# Altium schematic sheet BSPD_002.SchDoc: =DocumentName
size A3; Organization: Queen's Formula SAE; Address1: 130 Stuart St, Kingston; Address2: Ontario; Address3: Canada; Address4: K7L 2V9; DocumentNumber: 1; Revision: 0; SheetNumber: 1; SheetTotal: 1
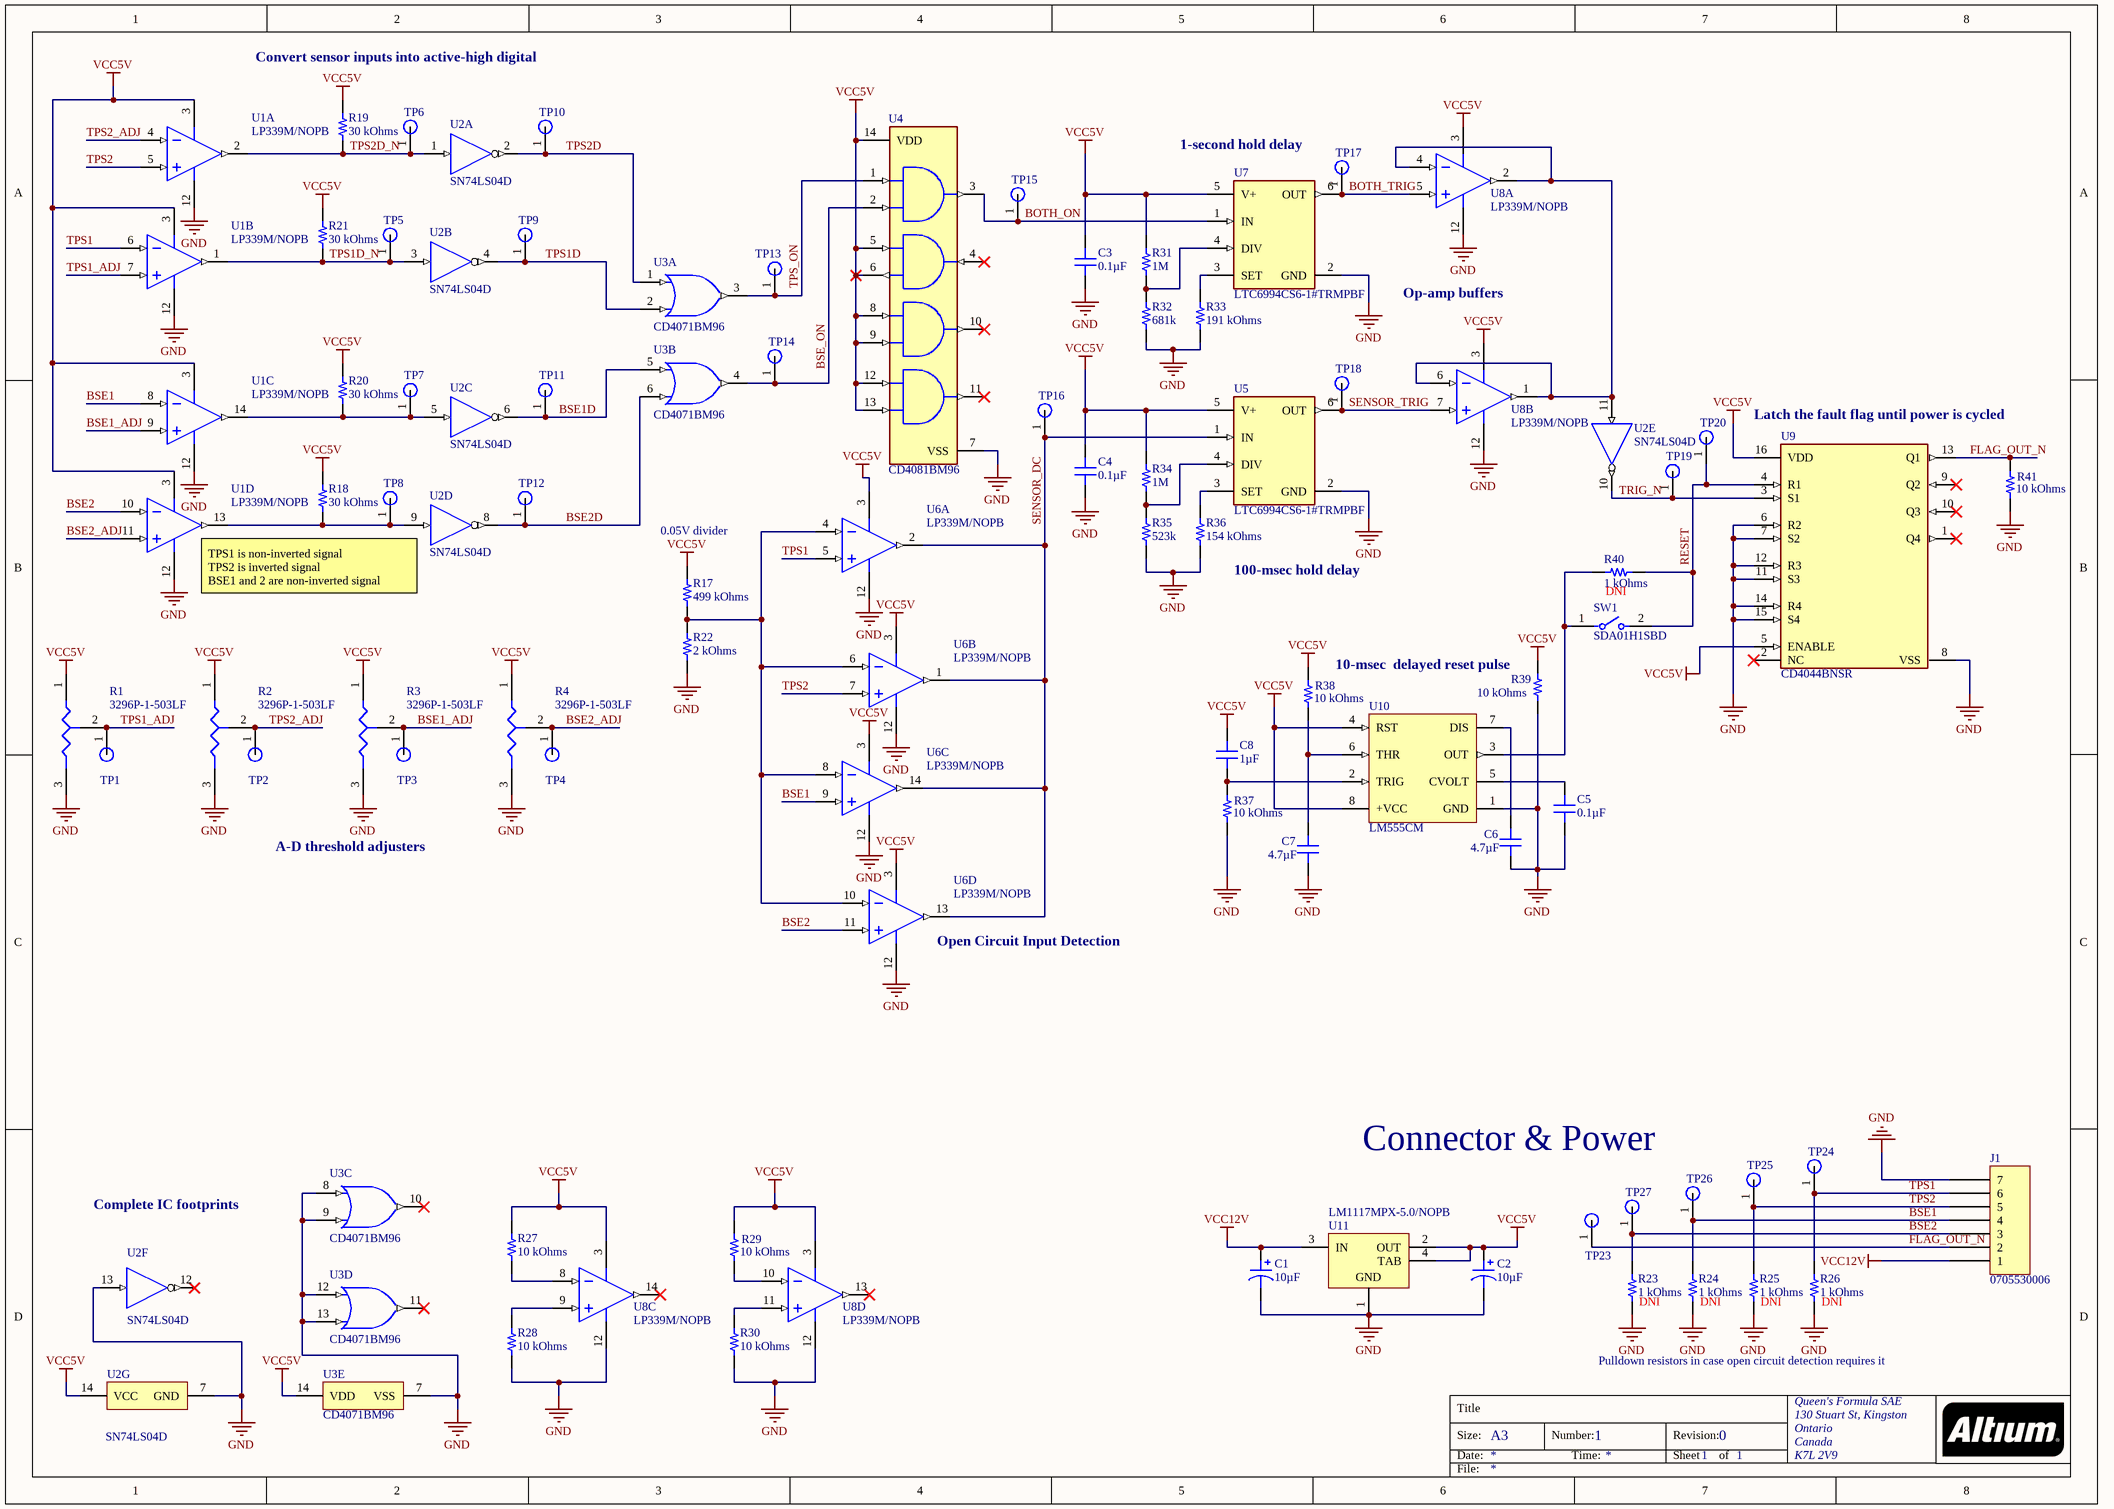
[diagram p0: BSPD_002.SchDoc]

## Parts
C1  10µF  [CAP ALSMD 5.3MM H5.4MM]
C2  10µF  [CAP ALSMD 5.3MM H5.4MM]
C3  0.1µF  [CAP 0805_2012]
C4  0.1µF  [CAP 0805_2012]
C5  0.1µF  [CAP 0805_2012]
C6  4.7µF  [CAP 0805_2012]
C7  4.7µF  [CAP 0805_2012]
C8  1µF  [CAP 0805_2012]
J1  0705530006  [MOLEX SDA-70553-7PIN]
R1  3296P-1-503LF  [3296P-1-503LF-Footprint-1]
R2  3296P-1-503LF  [3296P-1-503LF-Footprint-1]
R3  3296P-1-503LF  [3296P-1-503LF-Footprint-1]
R4  3296P-1-503LF  [3296P-1-503LF-Footprint-1]
R17  499 kOhms  [RES 0805_2012]
R18  30 kOhms  [RES 0805_2012]
R19  30 kOhms  [RES 0805_2012]
R20  30 kOhms  [RES 0805_2012]
R21  30 kOhms  [RES 0805_2012]
R22  2 kOhms  [RES 0805_2012]
R23  1 kOhms  [RES 0805_2012]  (net tie, no BOM)
R24  1 kOhms  [RES 0805_2012]  (net tie, no BOM)
R25  1 kOhms  [RES 0805_2012]  (net tie, no BOM)
R26  1 kOhms  [RES 0805_2012]  (net tie, no BOM)
R27  10 kOhms  [RES 0805_2012]
R28  10 kOhms  [RES 0805_2012]
R29  10 kOhms  [RES 0805_2012]
R30  10 kOhms  [RES 0805_2012]
R31  1M  [RES 0805_2012]
R32  681k  [RES 0805_2012]
R33  191 kOhms  [RES 0805_2012]
R34  1M  [RES 0805_2012]
R35  523k  [RES 0805_2012]
R36  154 kOhms  [RES 0805_2012]
R37  10 kOhms  [RES 0805_2012]
R38  10 kOhms  [RES 0805_2012]
R39  10 kOhms  [RES 0805_2012]
R40  1 kOhms  [RES 0805_2012]  (net tie, no BOM)
R41  10 kOhms  [RES 0805_2012]
SW1  SDA01H1SBD  [FP-SDA01H1SBD-MFG]
TP1  Test Point  [TP1]  (value not drawn)  (no BOM)
TP2  Test Point  [TP1]  (value not drawn)  (no BOM)
TP3  Test Point  [TP1]  (value not drawn)  (no BOM)
TP4  Test Point  [TP1]  (value not drawn)  (no BOM)
TP5  Test Point  [TP1]  (value not drawn)  (no BOM)
TP6  Test Point  [TP1]  (value not drawn)  (no BOM)
TP7  Test Point  [TP1]  (value not drawn)  (no BOM)
TP8  Test Point  [TP1]  (value not drawn)  (no BOM)
TP9  Test Point  [TP1]  (value not drawn)  (no BOM)
TP10  Test Point  [TP1]  (value not drawn)  (no BOM)
TP11  Test Point  [TP1]  (value not drawn)  (no BOM)
TP12  Test Point  [TP1]  (value not drawn)  (no BOM)
TP13  Test Point  [TP1]  (value not drawn)  (no BOM)
TP14  Test Point  [TP1]  (value not drawn)  (no BOM)
TP15  Test Point  [TP1]  (value not drawn)  (no BOM)
TP16  Test Point  [TP1]  (value not drawn)  (no BOM)
TP17  Test Point  [TP1]  (value not drawn)  (no BOM)
TP18  Test Point  [TP1]  (value not drawn)  (no BOM)
TP19  Test Point  [TP1]  (value not drawn)  (no BOM)
TP20  Test Point  [TP1]  (value not drawn)  (no BOM)
TP23  Test Point  [TP1]  (value not drawn)  (no BOM)
TP24  Test Point  [TP1]  (value not drawn)  (no BOM)
TP25  Test Point  [TP1]  (value not drawn)  (no BOM)
TP26  Test Point  [TP1]  (value not drawn)  (no BOM)
TP27  Test Point  [TP1]  (value not drawn)  (no BOM)
U1  LP339M/NOPB  [D0014A_L]  (parts A,B,C,D of 4)
U2  SN74LS04D  [D0014A_L]  (parts A,B,C,D,E,F,G of 7)
U3  CD4071BM96  [D0014A_L]  (parts A,B,C,D,E of 5)
U4  CD4081BM96  [FP-D0014A-MFG]
U5  LTC6994CS6-1#TRMPBF  [FP-S6-6-05-08-1636-MFG]
U6  LP339M/NOPB  [D0014A_L]  (parts A,B,C,D of 4)
U7  LTC6994CS6-1#TRMPBF  [FP-S6-6-05-08-1636-MFG]
U8  LP339M/NOPB  [D0014A_L]  (parts A,B,C,D of 4)
U9  CD4044BNSR  [FP-D0016A-MFG]
U10  LM555CM  [D0008A_L]
U11  LM1117MPX-5.0/NOPB  [DCY0004A_M]

## Nets
GND: C1.2 C2.2 C3.1 C4.1 C5.1 C6.2 C7.2 J1.7 R1.3(B) R2.3(B) R3.3(B) R4.3(B) R22.1 R23.1 R24.1 R25.1 R26.1 R28.1 R30.1 R32.1 R33.1 R35.1 R36.1 R37.1 R39.1 R41.1 U1.12(GND) U2.7(GND) U2.13(6A) U3.7(VSS) U3.8(E) U3.9(F) U3.12(G) U3.13(H) U4.7(VSS) U5.2(GND) U6.12(GND) U7.2(GND) U8.12(GND) U9.6(R2) U9.7(S2) U9.8(VSS) U9.11(S3) U9.12(R3) U9.14(R4) U9.15(S4) U10.1(GND) U11.1(GND)
VCC5V: C2.1 C3.2 C4.2 C8.2 R1.1(A) R2.1(A) R3.1(A) R4.1(A) R17.2 R18.2 R19.2 R20.2 R21.2 R27.2 R29.2 R31.1 R34.1 R38.2 R39.2 U1.3(V+) U2.14(VCC) U3.14(VDD) U4.5(C) U4.6(D) U4.8(E) U4.9(F) U4.12(G) U4.13(H) U4.14(VDD) U5.5(V+) U6.3(V+) U7.5(V+) U8.3(V+) U9.5(ENABLE) U9.16(VDD) U10.4(RST) U10.8(+VCC) U11.2(OUT) U11.4(TAB)
VCC12V: C1.1 J1.1 U11.3(IN)
BOTH_ON: TP15.1 U4.3(J) U7.1(IN)
BOTH_TRIG: TP17.1 U7.6(OUT) U8.5(IN1+)
BSE1: J1.4 R24.2 TP26.1 U1.8(IN3-) U6.9(IN3+)
BSE1_ADJ: R3.2(TAP) TP3.1 U1.9(IN3+)
BSE1D: TP11.1 U2.6(~{3Y}) U3.5(C)
BSE2: J1.3 R23.2 TP27.1 U1.10(IN4-) U6.11(IN4+)
BSE2_ADJ: R4.2(TAP) TP4.1 U1.11(IN4+)
BSE2D: TP12.1 U2.8(~{4Y}) U3.6(D)
BSE_ON: TP14.1 U3.4(K) U4.2(B)
FLAG_OUT_N: J1.2 R41.2 TP23.1 U9.13(Q1)
RESET: R40.1 SW1.2 TP20.1 U9.4(R1)
SENSOR_DC: TP16.1 U5.1(IN) U6.1(OUT2) U6.2(OUT1) U6.13(OUT4) U6.14(OUT3)
SENSOR_TRIG: TP18.1 U5.6(OUT) U8.7(IN2+)
TPS1: J1.6 R26.2 TP24.1 U1.6(IN2-) U6.5(IN1+)
TPS1_ADJ: R1.2(TAP) TP1.1 U1.7(IN2+)
TPS1D: TP9.1 U2.4(~{2Y}) U3.2(B)
TPS1D_N: R21.1 TP5.1 U1.1(OUT2) U2.3(2A)
TPS2: J1.5 R25.2 TP25.1 U1.5(IN1+) U6.7(IN2+)
TPS2_ADJ: R2.2(TAP) TP2.1 U1.4(IN1-)
TPS2D: TP10.1 U2.2(~{1Y}) U3.1(A)
TPS2D_N: R19.1 TP6.1 U1.2(OUT1) U2.1(1A)
TPS_ON: TP13.1 U3.3(J) U4.1(A)
TRIG_N: TP19.1 U2.10(~{5Y}) U9.3(S1)
NetC5_2: C5.2 U10.5(CVOLT)
NetC6_1: C6.1 U10.7(DIS)
NetC7_1: C7.1 R38.1 U10.6(THR)
NetC8_1: C8.1 R37.2 U10.2(TRIG)
NetR17_1: R17.1 R22.2 U6.4(IN1-) U6.6(IN2-) U6.8(IN3-) U6.10(IN4-)
NetR18_1: R18.1 TP8.1 U1.13(OUT4) U2.9(4A)
NetR20_1: R20.1 TP7.1 U1.14(OUT3) U2.5(3A)
NetR27_1: R27.1 U8.8(IN3-)
NetR28_2: R28.2 U8.9(IN3+)
NetR29_1: R29.1 U8.10(IN4-)
NetR30_2: R30.2 U8.11(IN4+)
NetR31_2: R31.2 R32.2 U7.4(DIV)
NetR33_2: R33.2 U7.3(SET)
NetR34_2: R34.2 R35.2 U5.4(DIV)
NetR36_2: R36.2 U5.3(SET)
NetR40_2: R40.2 SW1.1 U10.3(OUT)
NetU2_11: U2.11(5A) U8.1(OUT2) U8.2(OUT1) U8.4(IN1-) U8.6(IN2-)

Not connected (* = marked no-connect by the designer): U2 12(~{6Y})*; U3 10(L)* 11(M)*; U4 4(K)* 10(L)* 11(M)*; U8 13(OUT4)* 14(OUT3)*; U9 1(Q4)* 2(NC)* 9(Q2)* 10(Q3)*

## Notes on the sheet
- Convert sensor inputs into active-high digital
- 1-second hold delay
- Op-amp buffers
- Latch the fault flag until power is cycled
- (near U1) TPS1 is non-inverted signal
  TPS2 is inverted signal
  BSE1 and 2 are non-inverted signal
- (near R17) 0.05V divider
- (near R36) 100-msec hold delay
- (near R40) DNI
- (near R39) 10-msec  delayed reset pulse
- A-D threshold adjusters
- (near U6) Open Circuit Input Detection
- Connector & Power
- Complete IC footprints
- (near R23) DNI
- (near R24) DNI
- (near R25) DNI
- (near R26) DNI
- Pulldown resistors in case open circuit detection requires it
- Title
- Size:
- Date:
- A3
- Number:
- Time:
- Revision:
- Sheet
- of
- File:

## Library data of the parts
C1 C2 = EEE-1HA100WR: CAP ALUM 10UF 20% 50V SMD; Manufacturer: Panasonic Electronic Components; Lifetime @ Temp.: 1000 Hrs @ 85°C; Polarization: Polar; Ripple Current @ High Frequency: 45.9mA @ 10kHz; Ripple Current @ Low Frequency: 27mA @ 120Hz; Surface Mount Land Size: 0.209" L x 0.209" W (5.30mm x 5.30mm); Part Number: EEE-1HA100WR; Applications: Automotive; Capacitance: 10µF; ComponentLink1Description: Datasheet; ComponentLink1URL: //media.digikey.com/pdf/Data%20Sheets/Panasonic%20Electronic%20Components/S_Series,Type_V_Rev2018.pdf; ComponentLink2Description: DigiKey Link; ComponentLink2URL: http://digikey.com/product-detail/en/panasonic-electronic-components/EEE-1HA100WR/PCE3915CT-ND/766291; Device Package: Radial, Can - SMD; Height - Seated (Max): 0.213" (5.40mm); LastUpdated: 2020-09-02 1:25:23 AM; Lifecycle Status: Active; Minimum Order: 1; Mounting Type: Surface Mount; Operating Temperature: -40°C ~ 85°C; Package / Case: Radial, Can - SMD; Packaging: TapeAndReel; PartId: 7969; Part Status: Active; Price: 0.08; Ratings: AEC-Q200; Series: S; Size / Dimension: 0.197" Dia (5.00mm); Supplier 1: DigiKey; Supplier Part Number 1: PCE3915CT-ND; Tolerance: ±20%; Value: 10µF; Voltage - Rated: 50V
C3-C5 = VJ0805Y104KXXCW1BC: CAP CER 0.1UF 25V X7R 0805; Manufacturer: Vishay Vitramon; Tolerance: ±10%; Part Number: VJ0805Y104KXXCW1BC; Value: 0.1µF; Applications: General Purpose; Capacitance: 0.1µF; ComponentLink1Description: Datasheet; ComponentLink1URL: https://www.vishay.com/docs/28548/vjw1bcbascomseries.pdf; ComponentLink2Description: DigiKey Link; ComponentLink2URL: http://digikey.com/product-detail/en/vishay-vitramon/VJ0805Y104KXXCW1BC/720-1537-1-ND/421056; Device Package: 0805 (2012 Metric); LastUpdated: 2020-09-02 1:04:08 AM; Lifecycle Status: Active; Minimum Order: 1; Mounting Type: Surface Mount, MLCC; Operating Temperature: -55°C ~ 125°C; Package / Case: 0805 (2012 Metric); Packaging: TapeAndReel; PartId: 17950; Part Status: Active; Price: 0.05; Series: VJ; Size / Dimension: 0.079" L x 0.049" W (2.00mm x 1.25mm); Supplier 1: DigiKey; Supplier Part Number 1: 720-1537-1-ND; Temperature Coefficient: X7R; Thickness (Max): 0.037" (0.95mm); Voltage - Rated: 25V
C6 C7 = TMK212BBJ475KD-T: CAP CER 4.7UF 25V X5R 0805; Manufacturer: Taiyo Yuden; Tolerance: ±10%; Part Number: TMK212BBJ475KD-T; Value: 4.7µF; Applications: General Purpose; Capacitance: 4.7µF; ComponentLink1Description: Datasheet; ComponentLink1URL: https://www.yuden.co.jp/productdata/catalog/mlcc01_e.pdf; ComponentLink2Description: DigiKey Link; ComponentLink2URL: http://digikey.com/product-detail/en/taiyo-yuden/TMK212BBJ475KD-T/587-2992-1-ND/2714185; Device Package: 0805 (2012 Metric); LastUpdated: 2020-09-02 1:04:10 AM; Lifecycle Status: Active; Minimum Order: 1; Mounting Type: Surface Mount, MLCC; Operating Temperature: -55°C ~ 85°C; Package / Case: 0805 (2012 Metric); Packaging: TapeAndReel; PartId: 17055; Part Status: Active; Price: 0.05; Series: M; Size / Dimension: 0.079" L x 0.049" W (2.00mm x 1.25mm); Supplier 1: DigiKey; Supplier Part Number 1: 587-2992-1-ND; Temperature Coefficient: X5R; Thickness (Max): 0.037" (0.95mm); Voltage - Rated: 25V
C8 = VJ0805Y105KXXTW1BC: CAP CER 1UF 25V X7R 0805; Manufacturer: Vishay Vitramon; Tolerance: ±10%; Part Number: VJ0805Y105KXXTW1BC; Value: 1µF; Applications: General Purpose; Capacitance: 1µF; ComponentLink1Description: Datasheet; ComponentLink1URL: http://www.vishay.com/docs/28548/vjw1bcbascomseries.pdf; ComponentLink2Description: DigiKey Link; ComponentLink2URL: http://digikey.com/product-detail/en/vishay-vitramon/VJ0805Y105KXXTW1BC/720-1855-1-ND/9681499; Device Package: 0805 (2012 Metric); LastUpdated: 2020-09-02 1:04:16 AM; Lifecycle Status: Active; Minimum Order: 1; Mounting Type: Surface Mount, MLCC; Operating Temperature: -55°C ~ 125°C; Package / Case: 0805 (2012 Metric); Packaging: TapeAndReel; PartId: 15348; Part Status: Active; Price: 0.03; Series: VJ; Size / Dimension: 0.079" L x 0.049" W (2.00mm x 1.25mm); Supplier 1: DigiKey; Supplier Part Number 1: 720-1855-1-ND; Temperature Coefficient: X7R; Thickness (Max): 0.053" (1.35mm); Voltage - Rated: 25V
J1 = 0705530006: CONN HEADER R/A 7POS 2.54MM; Manufacturer: Molex; Contact Length - Mating: 0.240" (6.10mm); Contact Length - Post: 0.130" (3.30mm); Material Flammability Rating: UL94 V-0; Number of Positions: 7; Number of Positions Loaded: All; Pitch - Mating: 0.100" (2.54mm); Shrouding: Shrouded - 4 Wall; Style: Board to Cable/Wire; Voltage Rating: 250V; Part Number: 0705530006; ComponentLink1Description: Datasheet; ComponentLink1URL: https://www.molex.com/pdm_docs/sd/705530006_sd.pdf; ComponentLink2Description: DigiKey Link; ComponentLink2URL: http://digikey.com/product-detail/en/molex/0705530006/WM4905-ND/114971; Connector Type: Header; Contact Finish - Mating: Gold; Contact Finish - Post: Tin; Contact Finish Thickness - Mating: 15.0µin (0.38µm); Contact Material: Phosphor Bronze; Contact Shape: Square; Contact Type: Male Pin; Fastening Type: Latch Holder; Insulation Color: Black; Insulation Height: 0.215" (5.45mm); Insulation Material: Polyester, Glass Filled; LastUpdated: 2020-01-12 11:57:03 PM; Lifecycle Status: Active; Minimum Order: 1; Mounting Type: Through Hole, Right Angle; Number of Rows: 1; Operating Temperature: -40°C ~ 105°C; Packaging: Tube; PartId: 90; Part Status: Active; Price: 3.15; Series: SL 70553; Supplier 1: DigiKey; Supplier Part Number 1: WM4905-ND; Termination: Solder
R1-R4 = CMP-00000-2: 50k 10% Trimmer Potentiometer 25-Turn Cermet; Number of Turns: 25; Temperature Coefficient: 100ppm/°C; Power Rating: 500mW; Resistance: 50kR; Color: Blue; RoHS Compliant: Yes; Series: 3296; Technology: CERMET; Weight: 0.03oz; Length: 9.53mm; Taper: Linear; REACH SVHC: No SVHC; Max Operating Temperature: 125°C; Termination: Pin; Military Standard: Not; Tolerance: 10%; Depth: 11.55mm; Width: 9.53mm; Resistor Type: Cermet; Radiation Hardening: No; Packaging: Rail/Tube; Lead Free: Lead Free; Min Operating Temperature: -55°C; Mount: Panel,Through Hole,PCB; Height: 0.19inch; Max Power Dissipation: 500mW; Resistance Tolerance: 10%; Package Quantity: 50
R17 = RC0805FR-07499KL: RES SMD 499K OHM 1% 1/8W 0805; Manufacturer: Yageo; Power (Watts): 0.125W, 1/8W; Temperature Coefficient: ±100ppm/°C; Part Number: RC0805FR-07499KL; Value: 499 kOhms; ComponentLink1Description: Datasheet; ComponentLink1URL: https://www.yageo.com/upload/media/product/productsearch/datasheet/rchip/PYu-RC_Group_51_RoHS_L_10.pdf; ComponentLink2Description: DigiKey Link; ComponentLink2URL: http://digikey.com/product-detail/en/yageo/RC0805FR-07499KL/311-499KCRCT-ND/730934; Composition: Thick Film; Device Package: 0805 (2012 Metric); Features: Moisture Resistant; Height - Seated (Max): 0.024" (0.60mm); LastUpdated: 2020-09-02 1:14:58 AM; Lifecycle Status: Active; Minimum Order: 1; Number of Terminations: 2; Operating Temperature: -55°C ~ 155°C; Package / Case: 0805 (2012 Metric); Packaging: CutTape; PartId: 39438; Part Status: Active; Price: 0.10; Resistance: 499 kOhms; Series: RC; Size / Dimension: 0.079" L x 0.049" W (2.00mm x 1.25mm); Supplier 1: DigiKey; Supplier Part Number 1: 311-499KCRCT-ND; Supplier Device Package: 0805; Tolerance: ±1%
R18-R21 = RT0805DRD0730KL: RES SMD 30K OHM 0.5% 1/8W 0805; Manufacturer: Yageo; Power (Watts): 0.125W, 1/8W; Temperature Coefficient: ±25ppm/°C; Part Number: RT0805DRD0730KL; Value: 30 kOhms; ComponentLink1Description: Datasheet; ComponentLink1URL: https://www.yageo.com/upload/media/product/productsearch/datasheet/rchip/PYu-RT_1-to-0.01_RoHS_L_11.pdf; ComponentLink2Description: DigiKey Link; ComponentLink2URL: http://digikey.com/product-detail/en/yageo/RT0805DRD0730KL/311-2734-1-ND/6129153; Composition: Thin Film; Device Package: 0805 (2012 Metric); Height - Seated (Max): 0.024" (0.60mm); LastUpdated: 2020-09-02 1:14:54 AM; Lifecycle Status: Active; Minimum Order: 1; Number of Terminations: 2; Operating Temperature: -55°C ~ 155°C; Package / Case: 0805 (2012 Metric); Packaging: TapeAndReel; PartId: 41498; Part Status: Active; Price: 0.03; Resistance: 30 kOhms; Series: RT; Size / Dimension: 0.079" L x 0.049" W (2.00mm x 1.25mm); Supplier 1: DigiKey; Supplier Part Number 1: 311-2734-1-ND; Supplier Device Package: 0805; Tolerance: ±0.5%
R22 = RC0805FR-072KL: RES SMD 2K OHM 1% 1/8W 0805; Manufacturer: Yageo; Power (Watts): 0.125W, 1/8W; Temperature Coefficient: ±100ppm/°C; Part Number: RC0805FR-072KL; Value: 2 kOhms; ComponentLink1Description: Datasheet; ComponentLink1URL: https://www.yageo.com/upload/media/product/productsearch/datasheet/rchip/PYu-RC_Group_51_RoHS_L_10.pdf; ComponentLink2Description: DigiKey Link; ComponentLink2URL: http://digikey.com/product-detail/en/yageo/RC0805FR-072KL/311-2.00KCRCT-ND/730611; Composition: Thick Film; Device Package: 0805 (2012 Metric); Features: Moisture Resistant; Height - Seated (Max): 0.024" (0.60mm); LastUpdated: 2020-09-02 1:14:43 AM; Lifecycle Status: Active; Minimum Order: 1; Number of Terminations: 2; Operating Temperature: -55°C ~ 155°C; Package / Case: 0805 (2012 Metric); Packaging: CutTape; PartId: 46061; Part Status: Active; Price: 0.10; Resistance: 2 kOhms; Series: RC; Size / Dimension: 0.079" L x 0.049" W (2.00mm x 1.25mm); Supplier 1: DigiKey; Supplier Part Number 1: 311-2.00KCRCT-ND; Supplier Device Package: 0805; Tolerance: ±1%
R23-R26 R40 = RNCS0805BKE1K00: RES 1K OHM 0.1% 1/10W 0805; Manufacturer: Stackpole Electronics Inc; Power (Watts): 0.1W, 1/10W; Temperature Coefficient: ±25ppm/°C; Part Number: RNCS0805BKE1K00; Value: 1 kOhms; ComponentLink1Description: Datasheet; ComponentLink1URL: https://www.seielect.com/catalog/sei-rncs_rnch.pdf; ComponentLink2Description: DigiKey Link; ComponentLink2URL: http://digikey.com/product-detail/en/stackpole-electronics-inc/RNCS0805BKE1K00/RNCS0805BKE1K00CT-ND/1800170; Composition: Thin Film; Device Package: 0805 (2012 Metric); Features: Anti-Corrosive, Automotive AEC-Q200, Moisture Resistant; Height - Seated (Max): 0.026" (0.65mm); LastUpdated: 2020-09-02 1:15:24 AM; Lifecycle Status: Active; Minimum Order: 1; Number of Terminations: 2; Operating Temperature: -55°C ~ 155°C; Package / Case: 0805 (2012 Metric); Packaging: TapeAndReel; PartId: 27715; Part Status: Active; Price: 0.09; Ratings: AEC-Q200; Resistance: 1 kOhms; Series: RNCS; Size / Dimension: 0.079" L x 0.049" W (2.00mm x 1.25mm); Supplier 1: DigiKey; Supplier Part Number 1: RNCS0805BKE1K00CT-ND; Supplier Device Package: 0805; Tolerance: ±0.1%
R27-R30 R37-R39 R41 = RC0805FR-0710KL: RES SMD 10K OHM 1% 1/8W 0805; Manufacturer: Yageo; Power (Watts): 0.125W, 1/8W; Temperature Coefficient: ±100ppm/°C; Part Number: RC0805FR-0710KL; Value: 10 kOhms; ComponentLink1Description: Datasheet; ComponentLink1URL: https://www.yageo.com/upload/media/product/productsearch/datasheet/rchip/PYu-RC_Group_51_RoHS_L_10.pdf; ComponentLink2Description: DigiKey Link; ComponentLink2URL: http://digikey.com/product-detail/en/yageo/RC0805FR-0710KL/311-10.0KCRCT-ND/730482; Composition: Thick Film; Device Package: 0805 (2012 Metric); Features: Moisture Resistant; Height - Seated (Max): 0.024" (0.60mm); LastUpdated: 2020-09-02 1:14:43 AM; Lifecycle Status: Active; Minimum Order: 1; Number of Terminations: 2; Operating Temperature: -55°C ~ 155°C; Package / Case: 0805 (2012 Metric); Packaging: CutTape; PartId: 46046; Part Status: Active; Price: 0.10; Resistance: 10 kOhms; Series: RC; Size / Dimension: 0.079" L x 0.049" W (2.00mm x 1.25mm); Supplier 1: DigiKey; Supplier Part Number 1: 311-10.0KCRCT-ND; Supplier Device Package: 0805; Tolerance: ±1%
R31 R34 = RC0805FR-071ML: RES SMD 1M OHM 1% 1/8W 0805; Manufacturer: Yageo; Power (Watts): 0.125W, 1/8W; Resistance: 1 MOhms; Temperature Coefficient: ±100ppm/°C; Part Number: RC0805FR-071ML; Value: 1M; ComponentLink1Description: Datasheet; ComponentLink1URL: https://www.yageo.com/upload/media/product/productsearch/datasheet/rchip/PYu-RC_Group_51_RoHS_L_10.pdf; ComponentLink2Description: DigiKey Link; ComponentLink2URL: http://digikey.com/product-detail/en/yageo/RC0805FR-071ML/311-1.00MCRCT-ND/730392; Composition: Thick Film; Device Package: 0805 (2012 Metric); Features: Moisture Resistant; Height - Seated (Max): 0.024" (0.60mm); LastUpdated: 2020-09-02 1:14:43 AM; Lifecycle Status: Active; Minimum Order: 1; Number of Terminations: 2; Operating Temperature: -55°C ~ 155°C; Package / Case: 0805 (2012 Metric); Packaging: CutTape; PartId: 46052; Part Status: Active; Price: 0.10; Series: RC; Size / Dimension: 0.079" L x 0.049" W (2.00mm x 1.25mm); Supplier 1: DigiKey; Supplier Part Number 1: 311-1.00MCRCT-ND; Supplier Device Package: 0805; Tolerance: ±1%
R32 = RMCF0805FT681K: RES 681K OHM 1% 1/8W 0805; Manufacturer: Stackpole Electronics Inc; Power (Watts): 0.125W, 1/8W; Resistance: 681 kOhms; Temperature Coefficient: ±100ppm/°C; Part Number: RMCF0805FT681K; Value: 681k; ComponentLink1Description: Datasheet; ComponentLink1URL: https://www.seielect.com/catalog/sei-rmcf_rmcp.pdf; ComponentLink2Description: DigiKey Link; ComponentLink2URL: http://digikey.com/product-detail/en/stackpole-electronics-inc/RMCF0805FT681K/RMCF0805FT681KCT-ND/1942525; Composition: Thick Film; Device Package: 0805 (2012 Metric); Features: Automotive AEC-Q200; Height - Seated (Max): 0.026" (0.65mm); LastUpdated: 2020-09-02 1:15:15 AM; Lifecycle Status: Active; Minimum Order: 1; Number of Terminations: 2; Operating Temperature: -55°C ~ 155°C; Package / Case: 0805 (2012 Metric); Packaging: CutTape; PartId: 31690; Part Status: Active; Price: 0.10; Ratings: AEC-Q200; Series: RMCF; Size / Dimension: 0.079" L x 0.049" W (2.00mm x 1.25mm); Supplier 1: DigiKey; Supplier Part Number 1: RMCF0805FT681KCT-ND; Supplier Device Package: 0805; Tolerance: ±1%
R33 = RC0805FR-07191KL: RES SMD 191K OHM 1% 1/8W 0805; Manufacturer: Yageo; Power (Watts): 0.125W, 1/8W; Temperature Coefficient: ±100ppm/°C; Part Number: RC0805FR-07191KL; Value: 191 kOhms; ComponentLink1Description: Datasheet; ComponentLink1URL: https://www.yageo.com/upload/media/product/productsearch/datasheet/rchip/PYu-RC_Group_51_RoHS_L_10.pdf; ComponentLink2Description: DigiKey Link; ComponentLink2URL: http://digikey.com/product-detail/en/yageo/RC0805FR-07191KL/311-191KCRCT-ND/730607; Composition: Thick Film; Device Package: 0805 (2012 Metric); Features: Moisture Resistant; Height - Seated (Max): 0.024" (0.60mm); LastUpdated: 2020-09-02 1:15:03 AM; Lifecycle Status: Active; Minimum Order: 1; Number of Terminations: 2; Operating Temperature: -55°C ~ 155°C; Package / Case: 0805 (2012 Metric); Packaging: CutTape; PartId: 37104; Part Status: Active; Price: 0.10; Resistance: 191 kOhms; Series: RC; Size / Dimension: 0.079" L x 0.049" W (2.00mm x 1.25mm); Supplier 1: DigiKey; Supplier Part Number 1: 311-191KCRCT-ND; Supplier Device Package: 0805; Tolerance: ±1%
R35 = RC0805FR-07523KL: RES SMD 523K OHM 1% 1/8W 0805; Manufacturer: Yageo; Power (Watts): 0.125W, 1/8W; Resistance: 523 kOhms; Temperature Coefficient: ±100ppm/°C; Part Number: RC0805FR-07523KL; Value: 523k; ComponentLink1Description: Datasheet; ComponentLink1URL: https://www.yageo.com/upload/media/product/productsearch/datasheet/rchip/PYu-RC_Group_51_RoHS_L_10.pdf; ComponentLink2Description: DigiKey Link; ComponentLink2URL: http://digikey.com/product-detail/en/yageo/RC0805FR-07523KL/311-523KCRCT-ND/730970; Composition: Thick Film; Device Package: 0805 (2012 Metric); Features: Moisture Resistant; Height - Seated (Max): 0.024" (0.60mm); LastUpdated: 2020-09-02 1:15:04 AM; Lifecycle Status: Active; Minimum Order: 1; Number of Terminations: 2; Operating Temperature: -55°C ~ 155°C; Package / Case: 0805 (2012 Metric); Packaging: CutTape; PartId: 36890; Part Status: Active; Price: 0.10; Series: RC; Size / Dimension: 0.079" L x 0.049" W (2.00mm x 1.25mm); Supplier 1: DigiKey; Supplier Part Number 1: 311-523KCRCT-ND; Supplier Device Package: 0805; Tolerance: ±1%
R36 = RC0805FR-07154KL: RES SMD 154K OHM 1% 1/8W 0805; Manufacturer: Yageo; Power (Watts): 0.125W, 1/8W; Temperature Coefficient: ±100ppm/°C; Part Number: RC0805FR-07154KL; Value: 154 kOhms; ComponentLink1Description: Datasheet; ComponentLink1URL: https://www.yageo.com/upload/media/product/productsearch/datasheet/rchip/PYu-RC_Group_51_RoHS_L_10.pdf; ComponentLink2Description: DigiKey Link; ComponentLink2URL: http://digikey.com/product-detail/en/yageo/RC0805FR-07154KL/311-154KCRCT-ND/730563; Composition: Thick Film; Device Package: 0805 (2012 Metric); Features: Moisture Resistant; Height - Seated (Max): 0.024" (0.60mm); LastUpdated: 2020-09-02 1:15:04 AM; Lifecycle Status: Active; Minimum Order: 1; Number of Terminations: 2; Operating Temperature: -55°C ~ 155°C; Package / Case: 0805 (2012 Metric); Packaging: CutTape; PartId: 37017; Part Status: Active; Price: 0.10; Resistance: 154 kOhms; Series: RC; Size / Dimension: 0.079" L x 0.049" W (2.00mm x 1.25mm); Supplier 1: DigiKey; Supplier Part Number 1: 311-154KCRCT-ND; Supplier Device Package: 0805; Tolerance: ±1%
SW1 = CMP-00012-1: Switch DIP OFF ON SPST 1 Raised Slide 0.1A 24VDC Gull Wing 1000Cycles SMD Tube
TP1-TP20 TP23-TP27 = TP1
U1 U6 U8 = CMP-00006-1: TEXAS INSTRUMENTS   LP339M/NOPB   LOW POWER COMPARATOR, QUAD, 8 uS, SOIC-14; PartId: 1
U2 = CMP-00003-1: TEXAS INSTRUMENTS - SN74LS04D - HEX INVERTER, SMD, 74LS04, SOIC14; Turn-On Delay Time: 15ns; Max Supply Voltage: 5.25V; Number of Gates: 6; Number of Inputs: 1; Output Current: 8mA; Schmitt Trigger Input: No; Min Supply Voltage: 4.75V; Operating Supply Voltage: 5V; High Level Output Current: -400uA; Logic Function: Buffer,Inverter; Max Operating Temperature: 70°C; Part Number: SN74LS04D; Min Operating Temperature: 0°C; Width: 3.91mm; RoHS Compliant: Yes; Length: 8.65mm; Number of Pins: 14; Radiation Hardening: No; Low Level Output Current: 8mA; Propagation Delay: 15ns; Lead Free: Lead Free; Height: 1.58mm; Mount: Surface Mount; Case/Package: SOIC; Packaging: Rail/Tube; REACH SVHC: No SVHC; Series: 74LS; Technology: BIPOLAR; Package Quantity: 50; Number of Circuits: 6; Number of Bits: 6; Weight: 0.004564oz; Number of Elements: 6
U3 = CMP-00004-1: OR Gate 4-Element 2-IN CMOS 14-Pin SOIC T/R
U4 = CMP-00007-1: TEXAS INSTRUMENTS - CD4081BM96 - AND Gate, CD4081, 8 Input, 6.8 mA, 3 V to 18 V, SOIC-14
U5 U7 = CMP-00009-1: Programmable Delay Block 6-Pin TSOT-23 T/R
U9 = CMP-00008-2: IC, QUAD NAND R/S-LATCH, 3-STATE, SOP-16, FULL REEL; Latch Type:SR; Output Current:-; Propagation Delay:50ns; Supply Voltage Min:3V; Supply Voltage Max:18V; Logic Case Style:SOIC; No. of Pins:16; No. of Bits:4bit ;RoHS Compliant: Yes
U10 = CMP-00011-1: IC OSC SGL TIMER 100KHZ 8-SOIC
U11 = CMP-00010-1: 800-mA 15-V linear voltage regulator 4-SOT-223 0 to 125